# EAGLE schematic diakoptis_ver5 (EAGLE 6.1)
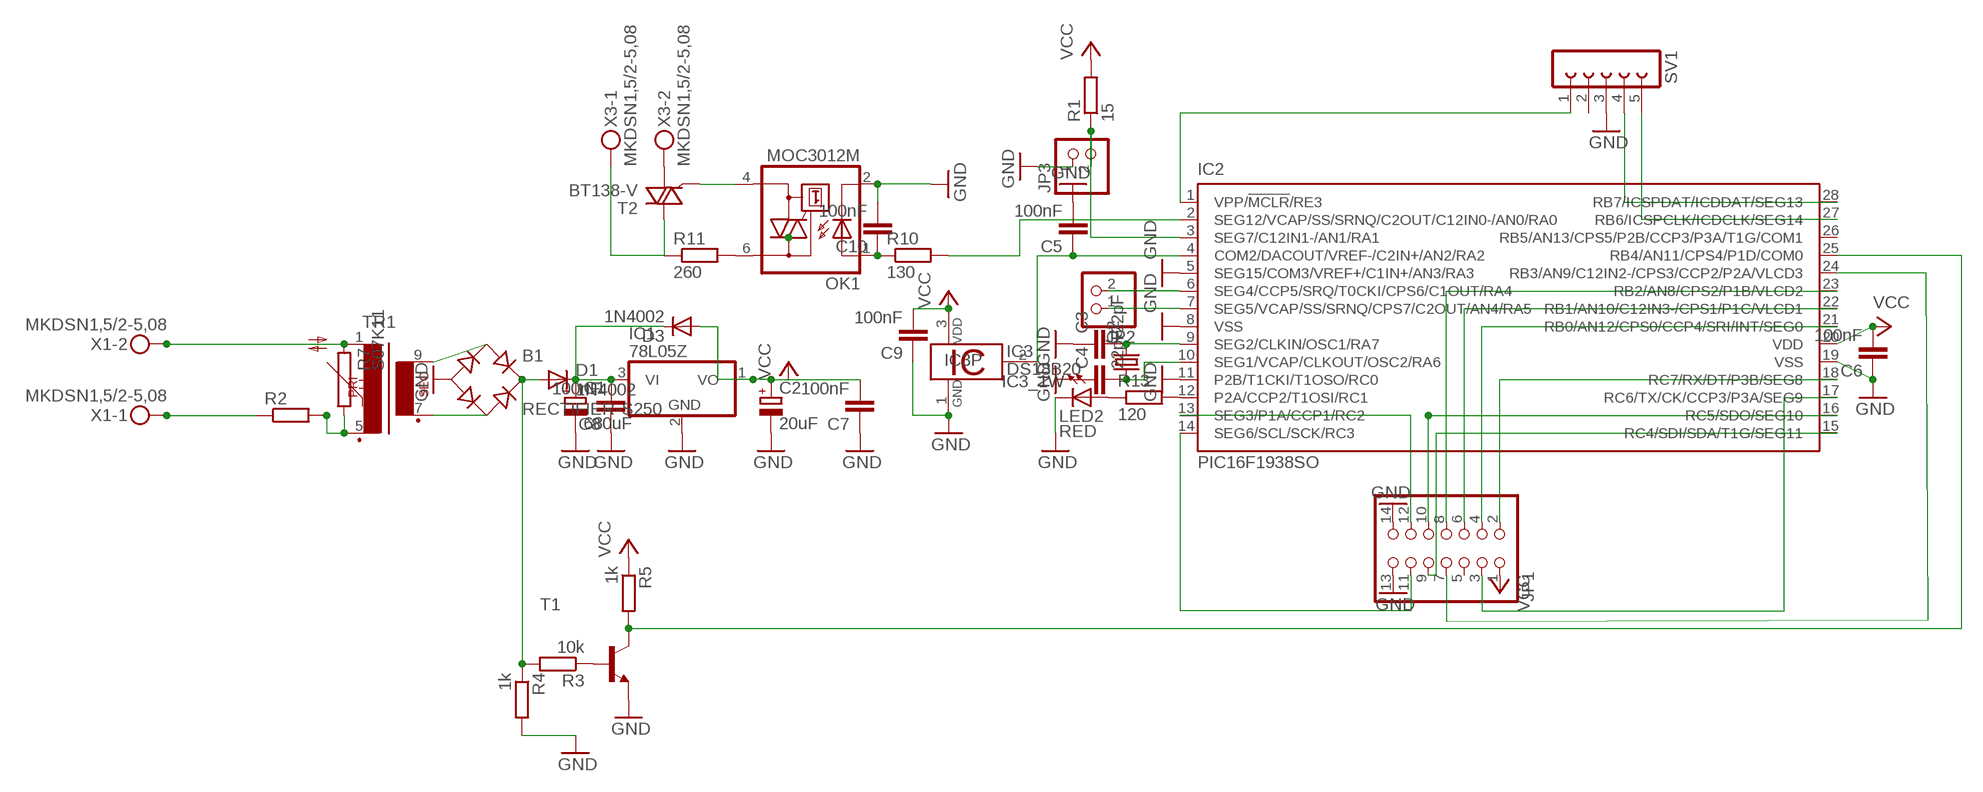
[diagram p0: schematic, sheet 1]

## Parts
B1  RECTIFIER-S250  [TO-269AA]
C1  680uF  CPOL-EUE3.5-10  [E3,5-10]
C2  20uF  CPOL-EUE1.8-4  [E1,8-4]
C3  22pF  C-EUC1206  [C1206]
C4  22pF  C-EUC1206  [C1206]
C5  100nF  C-EUC0805  [C0805]
C6  100nF  C2.5/2  [C2.5-2]
C7  100nF  C-EUC1206K  [C1206K]
C8  100nF  C-EUC1206K  [C1206K]
C9  100nF  C-EUC1206  [C1206]
C10  100nF  C-EUC1206K  [C1206K]
D1  1N4002  DIODE-D-5  [D-5]
D3  1N4002  DIODE-D-5  [D-5]
IC1  78L05Z  [TO92]
IC2  PIC16F1938SO  [SO28W]
IC3  DS18B20  [TO92-]
JP1  PINHD-2X7  [2X07]
JP2  PINHD-1X2  [1X02]
JP3  PINHD-1X2  [1X02]
LED2  RED  LED3MM  [LED3MM]
OK1  MOC3012M  [DIL06]
Q2  CRYSTALHC49U70  [HC49U70]
R1  15  R-EU_M1206  [M1206]
R2  R-EU_0204/5  [0204/5]
R3  10k  R-EU_M1206  [M1206]
R4  1k  R-EU_M1206  [M1206]
R5  1k  R-EU_M1206  [M1206]
R7  S07K11  [S07K11]
R10  130  R-EU_M1206  [M1206]
R11  260  R-EU_M1206  [M1206]
R13  120  R-EU_M1206  [M1206]
SV1  FE05-1  [FE05-1]
T1  BC549-NPN-TO92-CBE  [TO92-CBE]
T2  BT138-V  [TO220BV]
TR1  VR11MINI  [VR11MINI]
X1  MKDSN1,5/2-5,08  [MKDSN1,5/2-5,08]
X3  MKDSN1,5/2-5,08  [MKDSN1,5/2-5,08]

## Nets
GND: B1.- C1.- C2.- C3.1 C4.1 C5.2 C6.1 C7.1 C8.1 C9.1 C10.2 IC1.2(GND) IC2.5(SEG15/COM3/VREF+/C1IN+/AN3/RA3) IC2.8(VSS) IC2.11(P2B/T1CKI/T1OSO/RC0) IC2.19(VSS) IC3.1 JP1.13 JP1.14 JP3.1 LED2.K(C) OK1.2(C) R4.2 SV1.3 T1.E
N$1: IC2.3(SEG7/C12IN1-/AN1/RA1) JP3.2 R1.1
N$2: B1.AC2 TR1.7(S3)
N$4: B1.AC1 TR1.9(S4)
N$5: B1.+ D1.A R3.2 R4.1
N$6: C1.+ C8.2 D1.C D3.C IC1.3(VI)
N$7: R7.2 TR1.1 X1.2
N$8: IC2.13(SEG3/P1A/CCP1/RC2) JP1.12
N$9: R3.1 T1.B
N$10: IC2.18(RC7/RX/DT/P3B/SEG8) JP1.2
N$11: C3.2 IC2.9(SEG2/CLKIN/OSC1/RA7) Q2.2
N$12: C4.2 IC2.10(SEG1/VCAP/CLKOUT/OSC2/RA6) Q2.1
N$13: IC2.14(SEG6/SCL/SCK/RC3) JP1.11
N$14: IC2.15(RC4/SDI/SDA/T1G/SEG11) JP1.9
N$15: IC2.21(RB0/AN12/CPS0/CCP4/SRI/INT/SEG0) JP1.4
N$16: IC2.22(RB1/AN10/C12IN3-/CPS1/P1C/VLCD1) JP1.6
N$17: IC2.23(RB2/AN8/CPS2/P1B/VLCD2) JP1.8
N$19: IC2.24(RB3/AN9/C12IN2-/CPS3/CCP2/P2A/VLCD3) JP1.7
N$20: IC2.16(RC5/SDO/SEG10) JP1.10
N$22: IC2.17(RC6/TX/CK/CCP3/P3A/SEG9) JP1.3
N$23: R2.2 R7.1 TR1.5(P2)
N$24: IC2.1(VPP/!MCLR!/RE3) SV1.1
N$25: IC2.2(SEG12/VCAP/SS/SRNQ/C2OUT/C12IN0-/AN0/RA0) R10.2
N$26: IC2.25(RB4/AN11/CPS4/P1D/COM0) R5.2 T1.C
N$27: R2.1 X1.1
N$28: C5.1 IC2.4(COM2/DACOUT/VREF-/C2IN+/AN2/RA2) IC3.2
N$29: IC2.12(P2A/CCP2/T1OSI/RC1) R13.2
N$30: IC2.27(RB6/ICSPCLK/ICDCLK/SEG14) SV1.5
N$31: IC2.28(RB7/ICSPDAT/ICDDAT/SEG13) SV1.4
N$36: IC2.6(SEG4/CCP5/SRQ/T0CKI/CPS6/C1OUT/RA4) JP2.2
N$37: IC2.7(SEG5/VCAP/SS/SRNQ/CPS7/C2OUT/AN4/RA5) JP2.1
N$44: C10.1 OK1.1(A) R10.1
N$46: OK1.4(A1) T2.G
N$47: OK1.6(A2) R11.2
N$48: R11.1 T2.T2(A2) X3.1
N$49: T2.T1(A1) X3.2
N$53: LED2.A R13.1
VCC: C2.+ C6.2 C7.2 C9.2 D3.A IC1.1(VO) IC2.20(VDD) IC3.3 JP1.1 R1.2 R5.1
Unconnected: IC2.26(RB5/AN13/CPS5/P2B/CCP3/P3A/T1G/COM1) JP1.5 SV1.2

## Library data of the parts
B1 = rectifier:RECTIFIER-: Rectifier
C1 = rcl:CPOL-EU: POLARIZED CAPACITOR, European symbol
C2 = resistor:CPOL-EU: POLARIZED CAPACITOR, European symbol
C3-C5 C7-C10 = rcl:C-EU: CAPACITOR, European symbol
C6 = capacitor-wima:C: CAPACITOR naming: grid - package width
D1 D3 = diode:DIODE-: DIODE
IC1 = linear:78*: Positive VOLTAGE REGULATOR Source: http://cache.national.com/ds/LM/LM78L05.pdf http://www.fairchildsemi.com/ds/LM/LM7805.pdf
IC2 = microchip:PIC16F19*: Flash-Based, 8-Bit CMOS Microcontrollers wtih LCD Driver and nanoWatt XLP Technology Auto generated by make-symbol-device-package-bsdl.ulp Rev. 33 Source: http://ww1.microchip.com/downloads/en/DeviceDoc/41364D.pdf; MPN: PIC16F1938-I/SO; OC_FARNELL: 1755828; OC_NEWARK: 08R1948
IC3 = 1wire:DS18B20: Programmable Resolution Digital Thermometer This chip provides a onewire thermosensor with approx. 0.5°C accuracy. A programmable over/undertemperure alarm is available. The precision can be set from 9..12 bits. Notes: Vdd must be applied for accurate measurements at low temperatures, as the parasite power circuit otherwise heats the sensor. If parasite power is used, Vdd has to be connected to GND. The DS1822 is a low-cost thermometer chip, the DS18S20 is similar to the DS18B20, but with 9 Bit precision only. Author: Jan Kandziora <jjj@gmx.de>
JP1 = pinhead:PINHD-2X7: PIN HEADER
JP2 JP3 = pinhead:PINHD-1X2: PIN HEADER
LED2 = led:LED: LED OSRAM: - CHIPLED LG R971, LG N971, LY N971, LG Q971, LY Q971, LO R971, LY R971 LH N974, LH R974 LS Q976, LO Q976, LY Q976 LO Q996 - Hyper CHIPLED LW Q18S LB Q993, LB Q99A, LB R99A - SideLED LS A670, LO A670, LY A670, LG A670, LP A670 LB A673, LV A673, LT A673, LW A673 LH A674 LY A675 LS A676, LA A676, LO A676, LY A676, LW A676 LS A679, LY A679, LG A679 - Hyper Micro SIDELED® LS Y876, LA Y876, LO Y876, LY Y876 LT Y87S - SmartLED LW L88C, LW L88S LB L89C, LB L89S, LG L890 LS L89K, LO L89K, LY L89K LS L896, LA L896, LO L896, LY L896 - TOPLED LS T670, LO T670, LY T670, LG T670, LP T670 LSG T670, LSP T670, LSY T670, LOP T670, LYG T670 LG T671, LOG T671, LSG T671 LB T673, LV T673, LT T673, LW T673 LH T674 LS T676, LA T676, LO T676, LY T676, LB T676, LH T676, LSB T676, LW T676 LB T67C, LV T67C, LT T67C, LS T67K, LO T67K, LY T67K, LW E67C LS E67B, LA E67B, LO E67B, LY E67B, LB E67C, LV E67C, LT E67C LW T67C LS T679, LY T679, LG T679 LS T770, LO T770, LY T770, LG T770, LP T770 LB T773, LV T773, LT T773, LW T773 LH T774 LS E675, LA E675, LY E675, LS T675 LS T776, LA T776, LO T776, LY T776, LB T776 LHGB T686 LT T68C, LB T68C - Hyper Mini TOPLED® LB M676 - Mini TOPLED Santana® LG M470 LS M47K, LO M47K, LY M47K Source: http://www.osram.convergy.de LUXEON: - LUMILED® LXK2-PW12-R00, LXK2-PW12-S00, LXK2-PW14-U00, LXK2-PW14-V00 LXK2-PM12-R00, LXK2-PM12-S00, LXK2-PM14-U00 LXK2-PE12-Q00, LXK2-PE12-R00, LXK2-PE12-S00, LXK2-PE14-T00, LXK2-PE14-U00 LXK2-PB12-K00, LXK2-PB12-L00, LXK2-PB12-M00, LXK2-PB14-N00, LXK2-PB14-P00, LXK2-PB14-Q00 LXK2-PR12-L00, LXK2-PR12-M00, LXK2-PR14-Q00, LXK2-PR14-R00 LXK2-PD12-Q00, LXK2-PD12-R00, LXK2-PD12-S00 LXK2-PH12-R00, LXK2-PH12-S00 LXK2-PL12-P00, LXK2-PL12-Q00, LXK2-PL12-R00 Source: www.luxeon.com KINGBRIGHT: KA-3528ASYC Source: www.kingbright.com
OK1 = optocoupler:MOC30*M: RANDOM-PHASE OPTOISOLATORS TRIAC DRIVER OUTPUT Source: http://www.fairchildsemi.com MOC3020-M.pdf; MF: FAIRCHILD SEMICONDUCTOR; MPN: MOC3012-M; OC_FARNELL: 1021364; OC_NEWARK: 72K8894
Q2 = crystal:CRYSTAL: CRYSTAL; OC_FARNELL: unknown; OC_NEWARK: unknown
R1-R5 R10 R11 R13 = resistor:R-EU_: RESISTOR, European symbol
R7 = varistor:S07K11: VARISTOR
SV1 = con-lsta:FE05-1: FEMALE HEADER; OC_FARNELL: unknown; OC_NEWARK: unknown
T1 = transistor:*-NPN-: NPN Transistror BF959 corrected 2008.03.06
T2 = triac:BT138: TRIAC Source: http://www.semiconductors.philips.com BT138_SERIES_2.pdf
TR1 = mini_transformer:VR11MINI: TRANSFORMER 1 primary winding, 1 secondary winding BLOCK
X1 X3 = con-phoenix-508:MKDSN1,5/2-5,08: MKDSN 1,5/ 2-5,08 Printklemme Nennstrom: 13,5 A Nennspannung: 250 V Rastermaß: 5,08 mm Polzahl: 2 Anschlussart: Schraubanschluss Montage: Löten Anschlussrichtung Leiter/Platine: 0 ° Artikelnummer: 1729128 Source: http://eshop.phoenixcontact.com .. 1729128.pdf; MPN: MKDSN 1,5/2-5.08; OC_FARNELL: 1792903; OC_NEWARK: 30M2397